# Altium schematic sheet Stepper Motor5.SchDoc
size A2; SheetNumber: 8; SheetTotal: 9
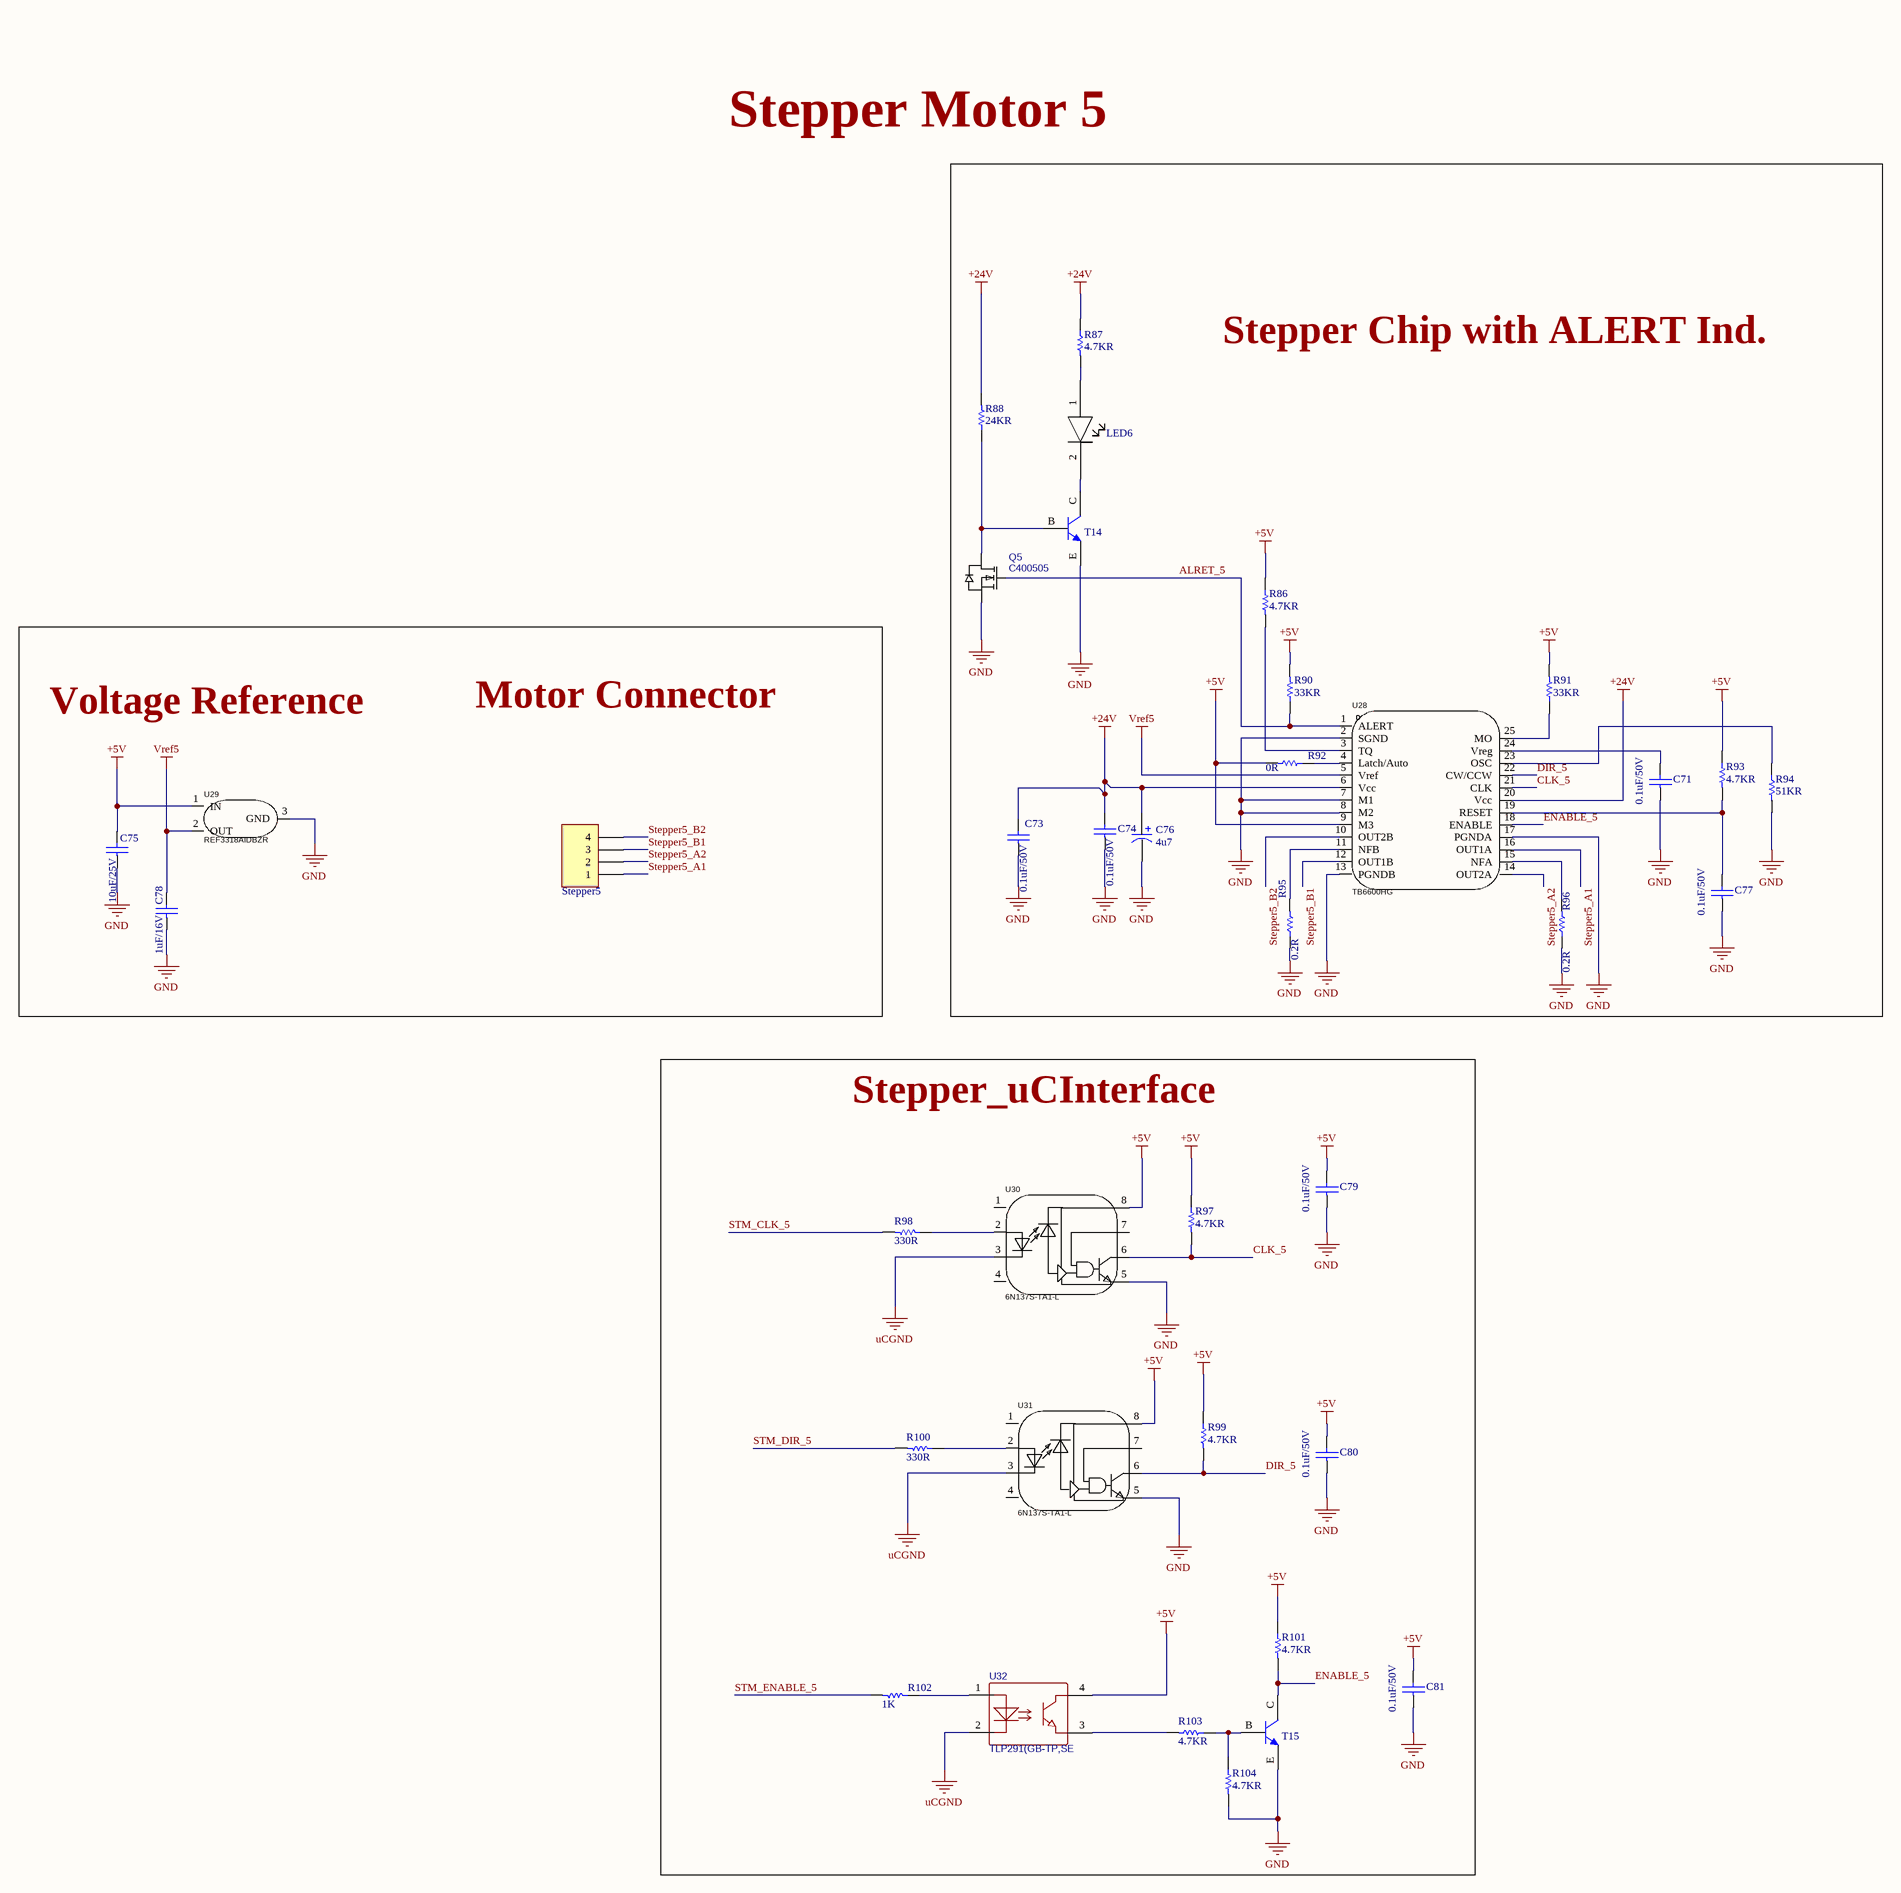
[diagram p0: Stepper Motor5.SchDoc]

## Parts
C71  0.1uF/50V  [PCBComponent_1]
C73  0.1uF/50V  [PCBComponent_1]
C74  0.1uF/50V  [PCBComponent_1]
C75  10uF/25V  [PCBComponent_1]
C76  4u7  [CAPLEAD_D6.3mm]
C77  0.1uF/50V  [PCBComponent_1]
C78  1uF/16V  [PCBComponent_1]
C79  0.1uF/50V  [PCBComponent_1]
C80  0.1uF/50V  [PCBComponent_1]
C81  0.1uF/50V  [PCBComponent_1]
LED6  1206 LED  [1206 LED]  (value not drawn)
Q5  C400505  [SOT-23-3_L2.9-W1.3-P1.90-LS2.4-BR]
R86  4.7KR  [R0402]
R87  4.7KR  [R0402]
R88  24KR  [RESC1608X06N]
R90  33KR  [RESC1608X06N]
R91  33KR  [RESC1608X06N]
R92  0R  [RESC1608X06N]
R93  4.7KR  [R0402]
R94  51KR  [R0402]
R95  0.2R  [RESC6431X12N]
R96  0.2R  [RESC6431X12N]
R97  4.7KR  [R0402]
R98  330R  [R0402]
R99  4.7KR  [R0402]
R100  330R  [R0402]
R101  4.7KR  [R0402]
R102  1K  [R0402]
R103  4.7KR  [R0402]
R104  4.7KR  [R0402]
Stepper5  Header 4 Pin Polar  [PCBComponent_1]  (value not drawn)
T14  MMBT3904 Transistor  [MMBT3904]  (value not drawn)
T15  MMBT3904 Transistor  [MMBT3904]  (value not drawn)
U28  TB6600HG  [HZIP25-P-1.0_TB6600HG - HEATSINK]
U29  REF3318AIDBZR  [SOT-23-3_L2.9-W1.3-P1.90-LS2.4-BR]
U30  6N137S-TA1-L  [SOP-8_L9.8-W6.6-P2.54-LS10.3-BL]
U31  6N137S-TA1-L  [SOP-8_L9.8-W6.6-P2.54-LS10.3-BL]
U32  TLP291(GB-TP,SE  [SOP-4-1.27mm]

## Blocks framed on the sheet
Stepper Chip with ALERT Ind.: C71 C73 C74 C76 C77 LED6 Q5 R86-R88 R90-R96 T14 U28
Stepper_uCInterface: C79-C81 R97-R104 T15 U30-U32

## Nets
+5V: C75.2 C79.2 C80.2 C81.2 R86.1 R90.2 R91.2 R92.2 R93.1 R97.1 R99.1 R101.1 U28.9(M3) U29.1(IN) U30.8 U31.8 U32.4
+24V: C73.2 C74.2 C76.1 R87.1 R88.2 U28.6(Vcc) U28.20(Vcc)
GND: C71.1 C73.1 C74.1 C75.1 C76.2 C77.1 C78.1 C79.1 C80.1 C81.1 Q5.2(S) R94.2 R95.1 R96.1 R104.2 T14.E T15.E U28.2(SGND) U28.7(M1) U28.8(M2) U28.13(PGNDB) U28.17(PGNDA) U29.3(GND) U30.5 U31.5
uCGND: U30.3 U31.3 U32.2
Vref5: C78.2 U28.5(Vref) U29.2(OUT)
ALRET_5: Q5.1(G) R90.1 U28.1(ALERT)
CLK_5: R97.2 U28.21(CLK) U30.6
DIR_5: R99.2 U28.22(CW/CCW) U31.6
ENABLE_5: R101.2 T15.C U28.18(ENABLE)
Stepper5_A1: Stepper5.1 U28.16(OUT1A)
Stepper5_A2: Stepper5.2 U28.14(OUT2A)
Stepper5_B1: Stepper5.3 U28.12(OUT1B)
Stepper5_B2: Stepper5.4 U28.10(OUT2B)
STM_CLK_5: R98.2
STM_DIR_5: R100.2
STM_ENABLE_5: R102.2
NetC71_2: C71.2 U28.24(Vreg)
NetC77_2: C77.2 R93.2 U28.19(RESET)
NetLED6_1: LED6.1 R87.2
NetLED6_2: LED6.2 T14.C
NetQ5_3: Q5.3(D) R88.1 T14.B
NetR86_2: R86.2 U28.3(TQ)
NetR91_1: R91.1 U28.25(MO)
NetR92_1: R92.1 U28.4(Latch/Auto)
NetR94_1: R94.1 U28.23(OSC)
NetR95_2: R95.2 U28.11(NFB)
NetR96_2: R96.2 U28.15(NFA)
NetR98_1: R98.1 U30.2
NetR100_1: R100.1 U31.2
NetR102_1: R102.1 U32.1
NetR103_1: R103.1 R104.1 T15.B
NetR103_2: R103.2 U32.3

Not connected (* = marked no-connect by the designer): U30 1(NC) 4(NC) 7; U31 1(NC) 4(NC) 7

## Notes on the sheet
- Stepper Motor 5
- Voltage Reference
- Motor Connector

## Library data of the parts
C71 C73 C74 C77 C79-C81 = 0603 Capacitor: C1591; Created By: NourAldin; DataSheet Link: https://eu.mouser.com/datasheet/2/400/lcc_automotive_general_en-843974.pdf; Mouser Link: https://eu.mouser.com/ProductDetail/TDK/CGA1A2X7R1H331M030BA?qs=sGAEpiMZZMs0AnBnWHyRQL8L3bkL%252bvtyS9XpSB1mk7rVV5K8%252bbxEeg%3d%3d
C75 = 0603 Capacitor: C96446; Created By: NourAldin; DataSheet Link: https://eu.mouser.com/datasheet/2/400/lcc_automotive_general_en-843974.pdf; Mouser Link: https://eu.mouser.com/ProductDetail/TDK/CGA1A2X7R1H331M030BA?qs=sGAEpiMZZMs0AnBnWHyRQL8L3bkL%252bvtyS9XpSB1mk7rVV5K8%252bbxEeg%3d%3d
C76 = A759EQ475M2AAAE160: C2691843; Manufacturer: KEMET; Supplier 1: Mouser; Manufacturer Part Number: A759EQ475M2AAAE160; RoHS: Yes; Category: Polymer Capacitors; Stock 1: 17219; Pricing 1: 1=0.97, 10=0.73, 50=0.73, 100=0.546, 1000=0.384, 10000=0.326 (USD); ComponentLink1URL: http://www.kemet.com/docfinder?Partnumber=A759EQ475M2AAAE160&src-supplier=Digikey; ComponentLink1Description: http://www.kemet.com/docfinder?Partnumber=A759EQ475M2AAAE160&src-supplier=Digikey; ComponentLink2URL: http://www.farnell.com/datasheets/2095614.pdf?src-supplier=Element14; ComponentLink2Description: http://www.farnell.com/datasheets/2095614.pdf?src-supplier=Element14; Supplier Part Number 1: 80-A759EQ475M2AAE160
C78 = 0603 Capacitor: C1592; Created By: NourAldin; DataSheet Link: https://eu.mouser.com/datasheet/2/400/lcc_automotive_general_en-843974.pdf; Mouser Link: https://eu.mouser.com/ProductDetail/TDK/CGA1A2X7R1H331M030BA?qs=sGAEpiMZZMs0AnBnWHyRQL8L3bkL%252bvtyS9XpSB1mk7rVV5K8%252bbxEeg%3d%3d
LED6 = 1206 LED: C434438; Created By: NourAldin
Q5 = BSS138_MOSFET: Manufacturer: YANGJIE(扬杰); Manufacturer Part: BSS138; Contributor: LCSC; Supplier: LCSC; Supplier Part: C400505; JLCPCB Part Class: Extended Part; spicePre: Q; spiceSymbolName: BSS138_C400505
R86 R87 R93 R97 R99 R101 R103 R104 = 0402 Resistor: C105871
R88 = 0603 Resistor: C2930081; Created By: NourAldin; Mouser Link: https://eu.mouser.com/ProductDetail/Panasonic/ERA-3AHD180V?qs=sGAEpiMZZMvdGkrng054t5mej2KPdPuFSlDBd1tSiF0%3d; DataSheet Link: https://eu.mouser.com/datasheet/2/315/AOA0000C307-1149632.pdf
R90 R91 = 0603 Resistor: C126359; Created By: NourAldin; Mouser Link: https://eu.mouser.com/ProductDetail/Panasonic/ERA-3AHD180V?qs=sGAEpiMZZMvdGkrng054t5mej2KPdPuFSlDBd1tSiF0%3d; DataSheet Link: https://eu.mouser.com/datasheet/2/315/AOA0000C307-1149632.pdf
R92 = 0603 Resistor: C100044; Created By: NourAldin; Mouser Link: https://eu.mouser.com/ProductDetail/Panasonic/ERA-3AHD180V?qs=sGAEpiMZZMvdGkrng054t5mej2KPdPuFSlDBd1tSiF0%3d; DataSheet Link: https://eu.mouser.com/datasheet/2/315/AOA0000C307-1149632.pdf
R94 = 0402 Resistor: C107230
R95 R96 = 2512 Resistor: C2903473; Created By: NourAldin; Mouser Link: https://eu.mouser.com/ProductDetail/Bourns/CSS2H-2512K-2L00F?qs=sGAEpiMZZMukHu%252bjC5l7YewuupLM8jZrvWs15Y6t0rY%3D&fbclid=IwAR0ZD_uc1Y03YG_KyYG8NxrpBzYgFzVeevvjxrlqtGWJ1HKz-jrYfqlFWCw; DataSheet Link: https://eu.mouser.com/datasheet/2/54/ss2h-2512-1302652.pdf
R98 R100 = 0402 Resistor: C105875
R102 = 0402 Resistor: C106235
Stepper5 = Header 4 Pin Polar: C144395
T14 T15 = MMBT3904 Transistor: C108429; Created By: NourAldin
U28 = TB6600HG: C66042; Manufacturer: TOSHIBA(东芝); Add into BOM: yes; Symbol: TB6600HG; Device: TB6600HG; LCSC Part Name: 4.5A 42V电机驱动芯片; Supplier Part: C66042; Manufacturer Part: TB6600HG; Supplier Footprint: HZIP-25-P-1mm; JLCPCB Part Class: Extended Part; Datasheet: https://atta.szlcsc.com/upload/public/pdf/source/20170511/1494500127812.pdf; Supplier: LCSC; Convert to PCB: yes
U29 = REF3318AIDBZR: C115877; Manufacturer: TI(德州仪器); Add into BOM: yes; Output Type: Fixed; Input Voltage: 2V~5.5V; Output Voltage: 1.8V; Output Current: 5mA; Tolerance: ±0.15%; Temperature Coefficient: 30ppm/℃; Reference Type: series connection; Supply Current: 8.5uA; Noise - 1/10Hz to 10Hz: 50uVp-p; Symbol: REF3318AIDBZR; Device: REF3318AIDBZR; LCSC Part Name: REF3318AIDBZR; Supplier Part: C115877; Manufacturer Part: REF3318AIDBZR; Supplier Footprint: SOT-23; JLCPCB Part Class: Extended Part; Datasheet: https://www.ti.com/cn/lit/gpn/ref3318; Supplier: LCSC; Convert to PCB: yes; Noise - 10Hz to 10kHz: -; Operating Temperature: -40℃~+125℃@(Ta)
U30 U31 = 6N137S-TA1-L: C92651; Manufacturer: LITEON(光宝); Add into BOM: yes; Input Type: DC; Supply Voltage: 4.5V~5.5V; Common Mode Transient Immunity (CMTI): 10kV/us; Data Rate: 15Mbit/s; Propagation Delay tpLH/tpHL: 32ns；40ns; Number of Channels: 1; Symbol: 6N137S-TA1; Device: 6N137S-TA1-L; LCSC Part Name: DC输入 1通道; Supplier Part: C92651; Manufacturer Part: 6N137S-TA1-L; Supplier Footprint: SOP-8-2.54mm; JLCPCB Part Class: Extended Part; Datasheet: https://atta.szlcsc.com/upload/public/pdf/source/20191018/C92651_D1F9F6F1F10C7EC7C3739E5ECB700036.pdf; Supplier: LCSC; Convert to PCB: yes; Operating Temperature: -40℃~+85℃
U32 = TLP291(GB-TP,SE(T: C55144; BOM_Manufacturer: TOSHIBA(东芝); BOM_Supplier: LCSC; Manufacturer Part Number: TLP291(GB-TP,SE; Supplier Part Number 2: C55144; BOM_JLCPCB Part Class: Extended Part; LCSC Link: https://www.lcsc.com/product-detail/Optocouplers-Phototransistor-Output_TOSHIBA-TLP291-GB-TP-SE_C55144.html; spiceSymbolName: TLP291(GB-TP,SE(T